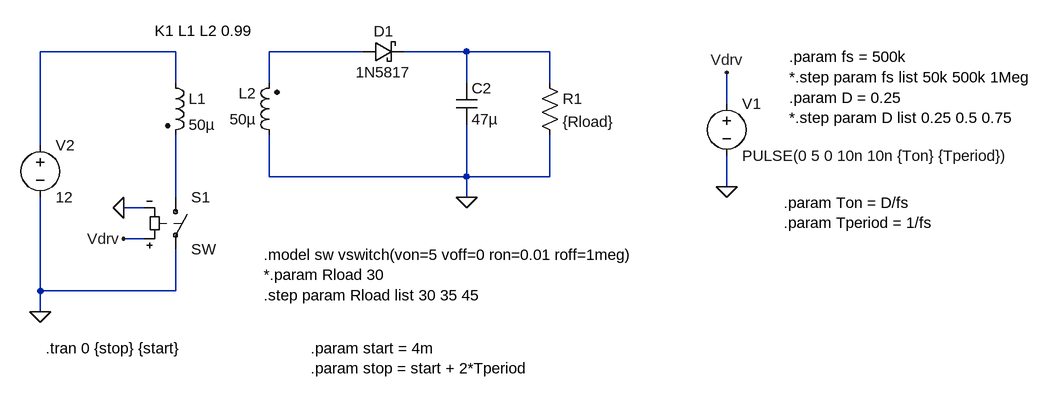
[diagram p0: schematic flyback_isolated.asc]
flyback_isolated.asc, the LTspice schematic file:
Version 4
SHEET 1 1804 680
WIRE -1040 80 -1248 80
WIRE -752 80 -896 80
WIRE -592 80 -688 80
WIRE -464 80 -592 80
WIRE -1040 128 -1040 80
WIRE -896 128 -896 80
WIRE -592 128 -592 80
WIRE -464 128 -464 80
WIRE -192 160 -192 112
WIRE -1248 224 -1248 80
WIRE -896 272 -896 208
WIRE -592 272 -592 192
WIRE -592 272 -896 272
WIRE -464 272 -464 208
WIRE -464 272 -592 272
WIRE -192 288 -192 240
WIRE -1040 304 -1040 208
WIRE -592 304 -592 272
WIRE -1088 320 -1120 320
WIRE -1088 368 -1120 368
WIRE -1248 448 -1248 304
WIRE -1040 448 -1040 384
WIRE -1040 448 -1248 448
WIRE -1248 480 -1248 448
FLAG -1248 480 0
FLAG -1120 368 Vdrv
FLAG -1120 320 0
FLAG -592 304 0
FLAG -192 288 0
FLAG -192 112 Vdrv
SYMBOL cap -608 128 R0
SYMATTR InstName C2
SYMATTR Value 47µ
SYMBOL schottky -752 96 R270
WINDOW 0 32 32 VTop 0
WINDOW 3 0 32 VBottom 0
SYMATTR InstName D1
SYMATTR Value 1N5817
SYMATTR Description Diode
SYMATTR Type diode
SYMBOL ind2 -1056 112 R0
SYMATTR InstName L1
SYMATTR Value 50µ
SYMBOL ind2 -880 224 R180
WINDOW 0 36 80 Left 0
WINDOW 3 36 40 Left 0
SYMATTR InstName L2
SYMATTR Value 50µ
SYMBOL voltage -192 144 R0
WINDOW 123 0 0 Left 0
WINDOW 39 0 0 Left 0
SYMATTR InstName V1
SYMATTR Value PULSE(0 5 0 10n 10n {Ton} {Tperiod})
SYMBOL res -480 112 R0
SYMATTR InstName R1
SYMATTR Value {Rload}
SYMBOL sw -1040 288 R0
SYMATTR InstName S1
SYMBOL voltage -1248 208 R0
WINDOW 123 0 0 Left 0
WINDOW 39 0 0 Left 0
SYMATTR InstName V2
SYMATTR Value 12
TEXT -904 392 Left 0 !.model sw vswitch(von=5 voff=0 ron=0.01 roff=1meg)\n*.param Rload 30\n.step param Rload list 30 35 45
TEXT -1072 48 Left 0 !K1 L1 L2 0.99
TEXT -96 88 Left 0 !.param fs = 500k\n*.step param fs list 50k 500k 1Meg\n.param D = 0.25\n*.step param D list 0.25 0.5 0.75
TEXT -104 312 Left 0 !.param Ton = D/fs\n.param Tperiod = 1/fs
TEXT -1240 536 Left 0 !.tran 0 {stop} {start}
TEXT -832 536 Left 0 !.param start = 4m\n.param stop = start + 2*Tperiod

The netlist it stands for:
* flyback_isolated.asc
C2 N003 0 47µ
D1 N002 N003 1N5817
L1 N001 N004 50µ
L2 0 N002 50µ
V1 Vdrv 0 PULSE(0 5 0 10n 10n {Ton} {Tperiod})
R1 N003 0 {Rload}
S1 N004 0 Vdrv 0 SW
V2 N001 0 12
.model D D
.lib standard.dio
.model sw vswitch(von=5 voff=0 ron=0.01 roff=1meg)
*.param Rload 30
.step param Rload list 30 35 45
K1 L1 L2 0.99
.param fs = 500k
*.step param fs list 50k 500k 1Meg
.param D = 0.25
*.step param D list 0.25 0.5 0.75
.param Ton = D/fs
.param Tperiod = 1/fs
.tran 0 {stop} {start}
.param start = 4m
.param stop = start + 2*Tperiod
.backanno
.end